# Altium project LISC-XC95144XL.PrjPCB
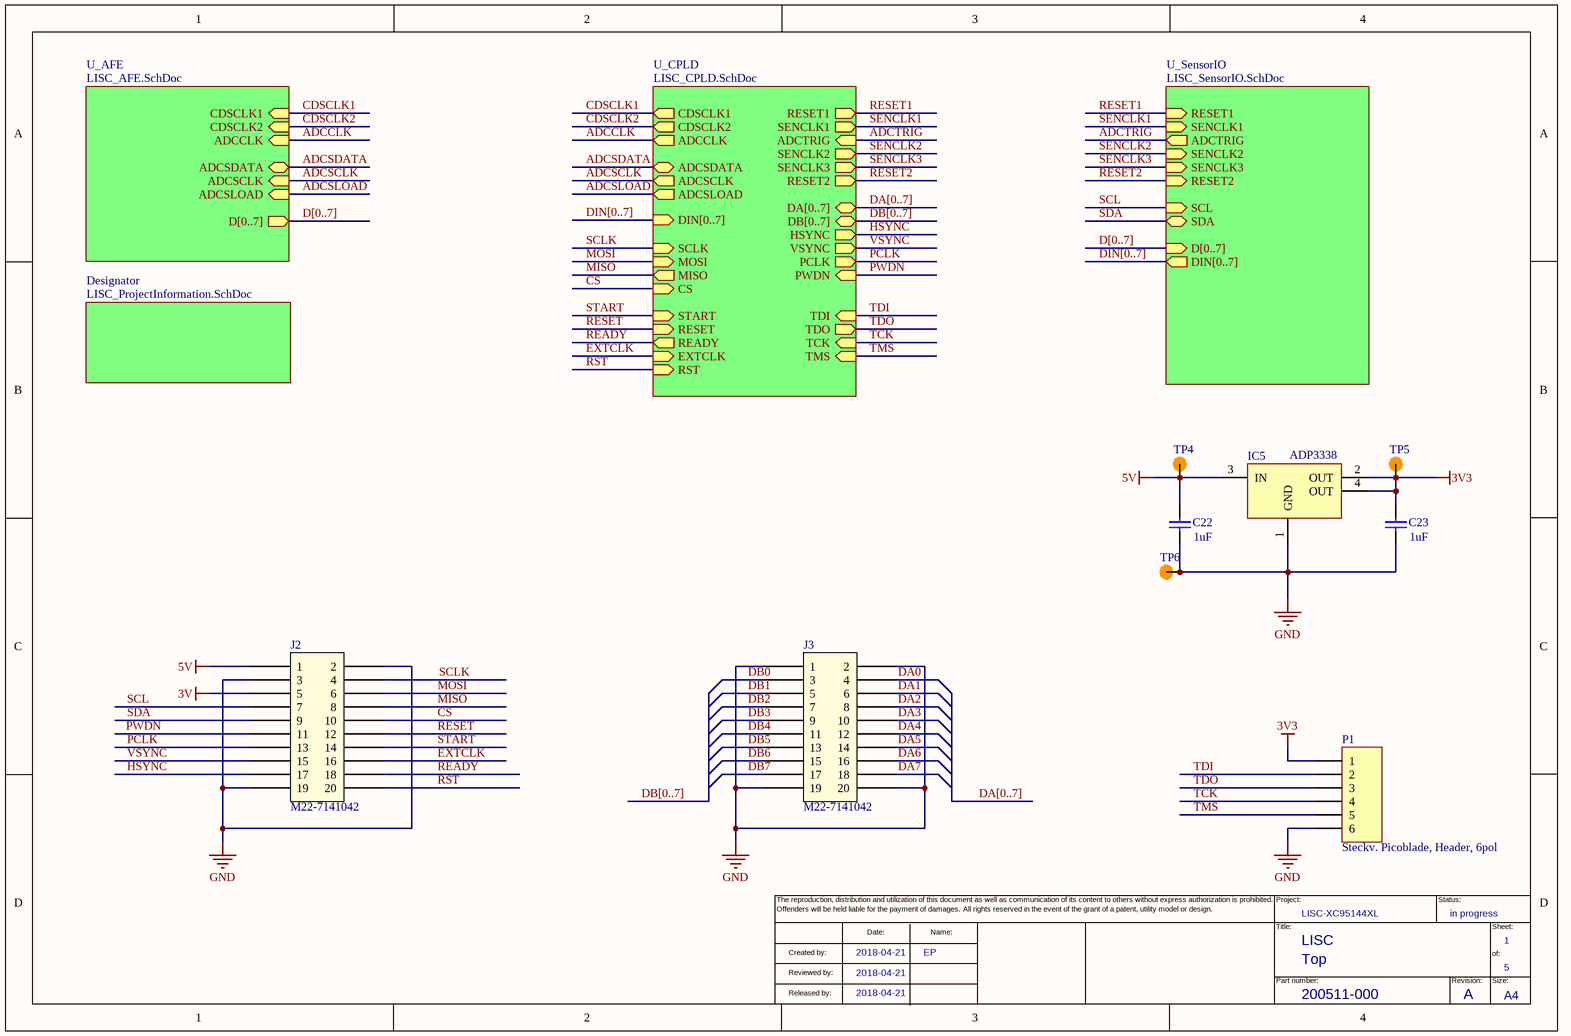
[diagram p0: LISC_TopLevel.SchDoc]
5 sheets, 47 parts. Net scope: hierarchical (ports join the sheet entries above them; power ports are global).
Board file: LISC-XC95144XL.PcbDoc
Sheets:
  LISC_TopLevel.SchDoc
    U_AFE = LISC_AFE.SchDoc
    U_SensorIO = LISC_SensorIO.SchDoc
    U_CPLD = LISC_CPLD.SchDoc
    Designator = LISC_ProjectInformation.SchDoc

## Sheet LISC_TopLevel.SchDoc: LISC
size A4; Date: 2018-04-21; Author: EP; Organization: eptecon; Revision: A; SheetNumber: 1; SheetTotal: 5; PartNumber: 200511-000; DesignStatus: in progress; Project: LISC-XC95144XL; SheetTitle: Top; ProjectName: Project Name

### Parts
C22  value 1uF  [1608[0603]]
C23  value 1uF  [1608[0603]]
IC5  ADP3338  [SOT223-4L]
J2  M22-7141042  [PCBComponent_1]
J3  M22-7141042  [PCBComponent_1]
P1  Steckv. Picoblade, Header, 6pol  [PicoBlade Header 6Pin gerade]
TP4  TP_SMD  [TP100_200_NS]  (value not drawn)
TP5  TP_SMD  [TP100_200_NS]  (value not drawn)
TP6  TP_SMD  [TP100_200_NS]  (value not drawn)

### Sub-sheets
Designator = LISC_ProjectInformation.SchDoc: no entries
U_AFE = LISC_AFE.SchDoc: CDSCLK1 (in), CDSCLK2 (in), ADCCLK (in), ADCSDATA (bidir), ADCSCLK (in), ADCSLOAD (in), D[0..7] (out)
U_CPLD = LISC_CPLD.SchDoc: RESET1 (out), SENCLK1 (out), SENCLK2 (out), SENCLK3 (out), RESET2 (out), ADCTRIG (in), CDSCLK1 (out), CDSCLK2 (out), ADCCLK (out), HSYNC (out), VSYNC (out), DA[0..7] (bidir), PCLK (out), PWDN (in), CS (in), MISO (out), MOSI (in), SCLK (in), READY (out), RESET (in), START (in), TDI (in), TDO (out), TCK (in), TMS (in), EXTCLK (in), ADCSDATA (bidir), ADCSCLK (out), ADCSLOAD (out), DIN[0..7] (in), DB[0..7] (bidir), RST (in)
U_SensorIO = LISC_SensorIO.SchDoc: RESET1 (in), SENCLK1 (in), SENCLK2 (in), SENCLK3 (in), RESET2 (in), ADCTRIG (out), SCL (in), SDA (bidir), D[0..7] (in), DIN[0..7] (out)

### Nets
3V: J2.5
3V3: C23.2 IC5.2(OUT) IC5.4(OUT) P1.1 TP5.1
5V: C22.2 IC5.3(IN) J2.1 TP4.1
GND: C22.1 C23.1 IC5.1(GND) J2.2 J2.3 J2.19 J3.1 J3.2 J3.19 J3.20 P1.6 TP6.1
ADCCLK: sheet U_AFE/ADCCLK, sheet U_CPLD/ADCCLK
ADCSCLK: sheet U_AFE/ADCSCLK, sheet U_CPLD/ADCSCLK
ADCSDATA: sheet U_AFE/ADCSDATA, sheet U_CPLD/ADCSDATA
ADCSLOAD: sheet U_AFE/ADCSLOAD, sheet U_CPLD/ADCSLOAD
ADCTRIG: sheet U_SensorIO/ADCTRIG, sheet U_CPLD/ADCTRIG
CDSCLK1: sheet U_AFE/CDSCLK1, sheet U_CPLD/CDSCLK1
CDSCLK2: sheet U_AFE/CDSCLK2, sheet U_CPLD/CDSCLK2
CS: J2.10 ; sheet U_CPLD/CS
DA0: J3.4
DA1: J3.6
DA2: J3.8
DA3: J3.10
DA4: J3.12
DA5: J3.14
DA6: J3.16
DA7: J3.18
DB0: J3.3
DB1: J3.5
DB2: J3.7
DB3: J3.9
DB4: J3.11
DB5: J3.13
DB6: J3.15
DB7: J3.17
EXTCLK: J2.16 ; sheet U_CPLD/EXTCLK
HSYNC: J2.17 ; sheet U_CPLD/HSYNC
MISO: J2.8 ; sheet U_CPLD/MISO
MOSI: J2.6 ; sheet U_CPLD/MOSI
PCLK: J2.13 ; sheet U_CPLD/PCLK
PWDN: J2.11 ; sheet U_CPLD/PWDN
READY: J2.18 ; sheet U_CPLD/READY
RESET: J2.12 ; sheet U_CPLD/RESET
RESET1: sheet U_SensorIO/RESET1, sheet U_CPLD/RESET1
RESET2: sheet U_SensorIO/RESET2, sheet U_CPLD/RESET2
RST: J2.20 ; sheet U_CPLD/RST
SCL: J2.7 ; sheet U_SensorIO/SCL
SCLK: J2.4 ; sheet U_CPLD/SCLK
SDA: J2.9 ; sheet U_SensorIO/SDA
SENCLK1: sheet U_SensorIO/SENCLK1, sheet U_CPLD/SENCLK1
SENCLK2: sheet U_SensorIO/SENCLK2, sheet U_CPLD/SENCLK2
SENCLK3: sheet U_SensorIO/SENCLK3, sheet U_CPLD/SENCLK3
START: J2.14 ; sheet U_CPLD/START
TCK: P1.4 ; sheet U_CPLD/TCK
TDI: P1.2 ; sheet U_CPLD/TDI
TDO: P1.3 ; sheet U_CPLD/TDO
TMS: P1.5 ; sheet U_CPLD/TMS
VSYNC: J2.15 ; sheet U_CPLD/VSYNC

### Buses and harness runs
bus D[0..7] = sheet U_AFE/D[0..7]
bus D[0..7] = sheet U_SensorIO/D[0..7]
bus DA[0..7]
bus DA[0..7] = sheet U_CPLD/DA[0..7]
bus DB[0..7]
bus DB[0..7] = sheet U_CPLD/DB[0..7]
bus DIN[0..7] = sheet U_CPLD/DIN[0..7]
bus DIN[0..7] = sheet U_SensorIO/DIN[0..7]

### Notes on the sheet
- The reproduction, distribution and utilization of this document as well as communication of its content to others without express authorization is prohibited.
- Offenders will be held liable for the payment of damages.
- All rights reserved in the event of the grant of a patent, utility model or design.
- Project:
- Status:
- Created by:
- Reviewed by:
- Date:
- Name:
- Title:
- Part number:
- Revision:
- Size:
- Sheet:
- of:
- Released by:
- A4

### Library data of the parts
C22 C23 = Cap Semi: Capacitor (Semiconductor SIM Model); Published: 8-Jun-2000; LatestRevisionDate: 29-May-2009; LatestRevisionNote: IPC-7351 Footprint Added.; PackageReference: C1206; Publisher: Altium Limited; PackageDescription: Chip Capacitor
IC5 = ADP3338: High Accuracy, Ultralow IQ, 1 A,  anyCAP® Low Dropout Regulator; Value: ADP3338; Supplier 1: Farnell; Supplier Part Number 1: 1651283
J2 J3 = M22-7141042: Harwig M22-7141042
P1 = 1.25mm Pitch PicoBlade™ Wire-to-Board Header, Vertical, with Friction Lock, 6 Circuits: MOLEX - 53047-0610 - STECKER,VERTIKAL,6KONT; Steckverbindertyp: Draht zu Platine; Kontaktanschluss: Durchsteckmontage, vertikal; Kontakte, Anzahl der: 6; Reihen, Anzahl der: 1; Raster: 1.25; Kontaktüberzug: Zinn; Kontaktmaterial: Phosphor-Bronze; Anschlussart: Lötmittel; Gehäusetyp: GF Nylon UL94V-0; Isolations-Widerstand: 100; Länge/Höhe, Außen-: 3.5; Min Betriebstemperatur: -40; Spannung, Betriebs-: 125; Spannung, Steh-: 250; Temperatur, Betriebs- max.: 85; Tiefe, Außen: 5.5; Supplier 1: Farnell; Manufacturer: MOLEX; Manufacturer Part Number: 53047-0610; RoHS: YES; Stock 1: 35787; Pricing 1: 5=0,673, 100=0,42, 250=0,358, 500=0,34, 1000=0,311 (EUR); Serie: PicoBlade; Gender: Header; Anschlusstyp: Draht zu Platine; Body Plating: Zinn; Nennstrom: 1; Pole, Anzahl der: 6; Raster, Anschluss: 1.25; Spannung, Nenn-, AC: 125; Wege, Anzahl der: 6; ComponentLink1URL: http://www.farnell.com/cad/694680.pdf; ComponentLink1Description: http://www.farnell.com/cad/694680.pdf; ComponentLink2URL: http://www.farnell.com/datasheets/524695.pdf; ComponentLink2Description: http://www.farnell.com/datasheets/524695.pdf; Supplier Part Number 1: 9733078

## Sheet LISC_AFE.SchDoc: LISC
size A4; Date: 2018-04-21; Author: EP; Organization: eptecon; Revision: A; SheetNumber: 3; SheetTotal: 5; PartNumber: 200511-000; DesignStatus: in progress; Project: LISC-XC95144XL; SheetTitle: Analog Frontend; ProjectName: Project Name
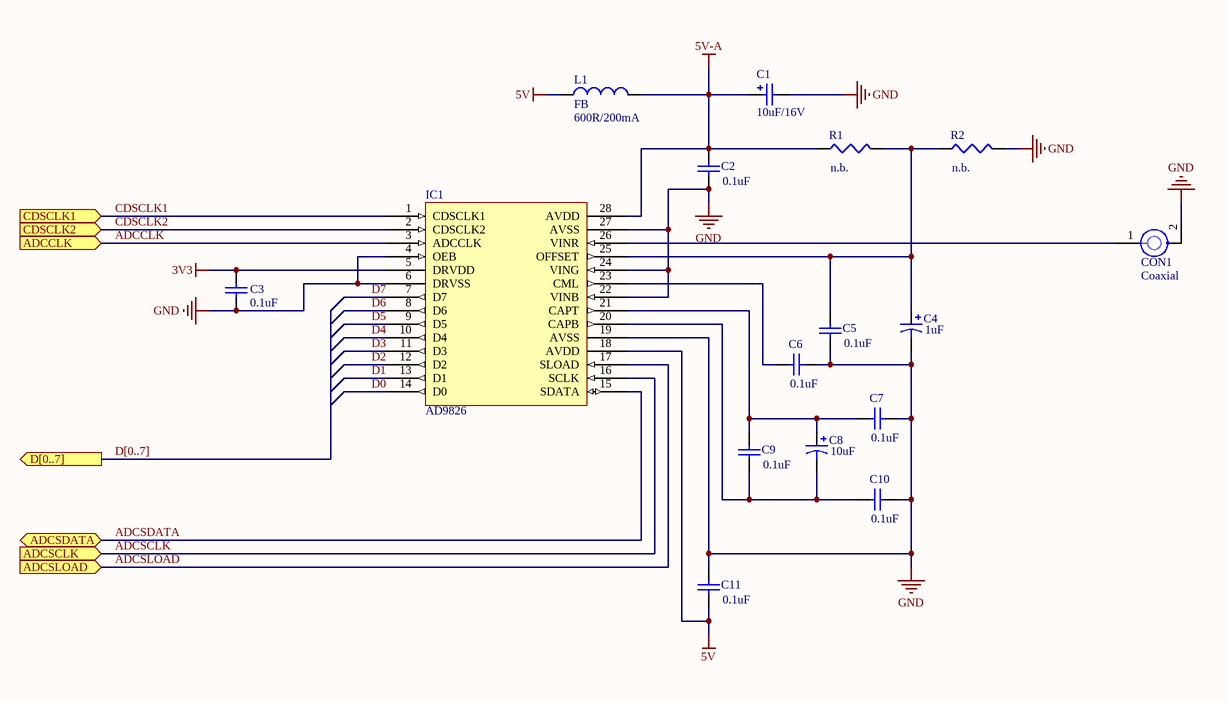
[diagram p1: LISC_AFE.SchDoc]

### Parts
C1  10uF/16V  [C1210 Pol]
C2  value 0.1uF  [1608[0603]]
C3  value 0.1uF  [1608[0603]]  (hidden comment: Cap Semi)
C4  value 1uF  [C0805]
C5  value 0.1uF  [1608[0603]]
C6  value 0.1uF  [1608[0603]]
C7  value 0.1uF  [1608[0603]]
C8  value 10uF  [C0805]
C9  value 0.1uF  [1608[0603]]
C10  value 0.1uF  [1608[0603]]
C11  value 0.1uF  [1608[0603]]
CON1  Coaxial  [U.FL-R-SMT]
IC1  AD9826  [SOP65P780-28AM]
L1  FB  value 600R/200mA  [INDC1608L]
R1  value n.b.  [J1-0603]
R2  value n.b.  [J1-0603]

### Ports
ADCCLK (in), ADCSCLK (in), ADCSDATA (bidir), ADCSLOAD (in), CDSCLK1 (in), CDSCLK2 (in), D[0..7] (out)

### Nets
3V3: C3.1 IC1.5(DRVDD)
5V: C11.1 IC1.18(AVDD) L1.1
5V-A: C1.1 C2.2 IC1.28(AVDD) L1.2 R1.1
GND: C1.2 C2.1 C3.2 C4.2 C5.1 C6.1 C7.1 C10.1 C11.2 CON1.2 IC1.4(OEB) IC1.6(DRVSS) IC1.19(AVSS) IC1.22(VINB) IC1.24(VING) IC1.27(AVSS) R2.2
ADCCLK: IC1.3(ADCCLK) ; port ADCCLK
ADCSCLK: IC1.16(SCLK) ; port ADCSCLK
ADCSDATA: IC1.15(SDATA) ; port ADCSDATA
ADCSLOAD: IC1.17(SLOAD) ; port ADCSLOAD
CDSCLK1: IC1.1(CDSCLK1) ; port CDSCLK1
CDSCLK2: IC1.2(CDSCLK2) ; port CDSCLK2
D0: IC1.14(D0)
D1: IC1.13(D1)
D2: IC1.12(D2)
D3: IC1.11(D3)
D4: IC1.10(D4)
D5: IC1.9(D5)
D6: IC1.8(D6)
D7: IC1.7(D7)
NetC4_1: C4.1 C5.2 IC1.25(OFFSET) R1.2 R2.1
NetC6_2: C6.2 IC1.23(CML)
NetC7_2: C7.2 C8.1 C9.2 IC1.21(CAPT)
NetC8_2: C8.2 C9.1 C10.2 IC1.20(CAPB)
NetCON1_1: CON1.1 IC1.26(VINR)

### Buses and harness runs
bus D[0..7] = port D[0..7]

### Notes on the sheet
- The reproduction, distribution and utilization of this document as well as communication of its content to others without express authorization is prohibited.
- Offenders will be held liable for the payment of damages.
- All rights reserved in the event of the grant of a patent, utility model or design.
- Project:
- Status:
- Created by:
- Reviewed by:
- Date:
- Name:
- Title:
- Part number:
- Revision:
- Size:
- Sheet:
- of:
- Released by:
- A4

### Library data of the parts
C1 = Cap EU SMD Pol: Polarized Capacitor (Surface Mount); Value: 10uF; Published: 8-Jun-2000; LatestRevisionDate: 29-May-2009; LatestRevisionNote: IPC-7351 Footprint Added.; PackageReference: C0805; Publisher: Altium Limited; PackageDescription: Chip Capacitor
C2 C3 C5-C7 C9-C11 = Cap Semi: Capacitor (Semiconductor SIM Model); Published: 8-Jun-2000; LatestRevisionDate: 29-May-2009; LatestRevisionNote: IPC-7351 Footprint Added.; PackageReference: C1206; Publisher: Altium Limited; PackageDescription: Chip Capacitor
C4 C8 = Cap Pol3: Polarized Capacitor (Surface Mount); Published: 8-Jun-2000; LatestRevisionDate: 29-May-2009; LatestRevisionNote: IPC-7351 Footprint Added.; PackageReference: C0805; Publisher: Altium Limited; PackageDescription: Chip Capacitor
L1 = Inductor: Code_IEC: 1005; Published: 8-Jun-2000; LatestRevisionDate: 29-May-2009; LatestRevisionNote: IPC-7351 Footprint Added.; PackageReference: 0402-A; Publisher: Altium Limited; PackageDescription: Chip Inductor; Code_JEITA: 0402
R1 R2 = Res3: Resistor; Published: 8-Jun-2000; LatestRevisionDate: 29-May-2009; LatestRevisionNote: IPC-7351 Footprint Added.; PackageReference: J1-0603; Publisher: Altium Limited; PackageDescription: Chip Resistor

## Sheet LISC_SensorIO.SchDoc: LISC
size A4; Date: 2018-04-21; Author: EP; Organization: eptecon; Revision: A; SheetNumber: 5; SheetTotal: 5; PartNumber: 200511-000; DesignStatus: in progress; Project: LISC-XC95144XL; SheetTitle: Sensor I/O; ProjectName: Project Name
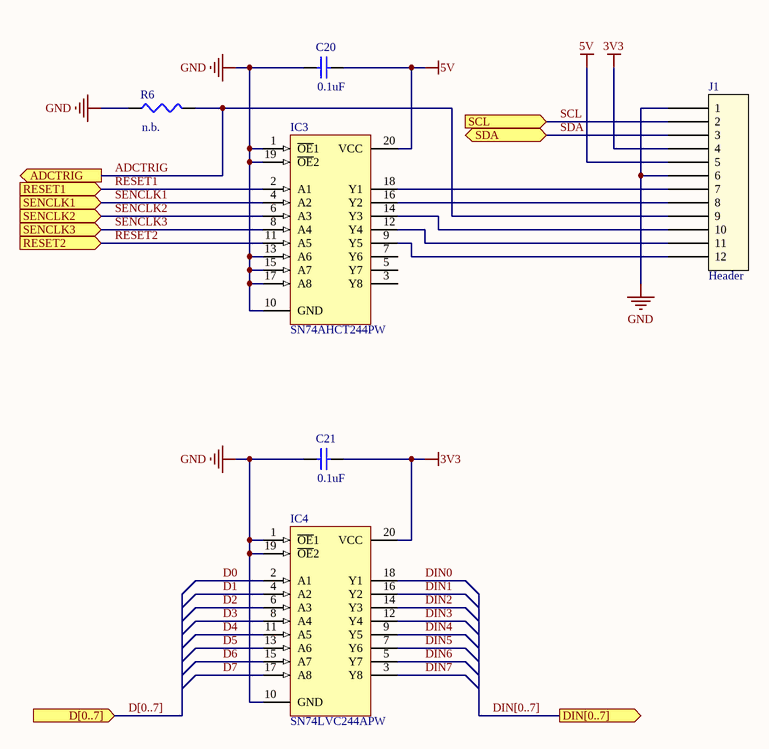
[diagram p2: LISC_SensorIO.SchDoc]

### Parts
C20  value 0.1uF  [1608[0603]]
C21  value 0.1uF  [1608[0603]]
IC3  SN74AHCT244PW  [PW020_M]
IC4  SN74LVC244APW  [PW020_M]
J1  Header  [Molex_Picoflex_12]
R6  value n.b.  [J1-0603]

### Ports
ADCTRIG (out), D[0..7] (in), DIN[0..7] (out), RESET1 (in), RESET2 (in), SCL (in), SDA (bidir), SENCLK1 (in), SENCLK2 (in), SENCLK3 (in)

### Nets
3V3: C21.2 IC4.20(VCC) J1.4
5V: C20.2 IC3.20(VCC) J1.5
GND: C20.1 C21.1 IC3.1(~{OE}1) IC3.10(GND) IC3.13(A6) IC3.15(A7) IC3.17(A8) IC3.19(~{OE}2) IC4.1(~{OE}1) IC4.10(GND) IC4.19(~{OE}2) J1.1 J1.6 R6.1
ADCTRIG: J1.9 R6.2 ; port ADCTRIG
D0: IC4.2(A1)
D1: IC4.4(A2)
D2: IC4.6(A3)
D3: IC4.8(A4)
D4: IC4.11(A5)
D5: IC4.13(A6)
D6: IC4.15(A7)
D7: IC4.17(A8)
DIN0: IC4.18(Y1)
DIN1: IC4.16(Y2)
DIN2: IC4.14(Y3)
DIN3: IC4.12(Y4)
DIN4: IC4.9(Y5)
DIN5: IC4.7(Y6)
DIN6: IC4.5(Y7)
DIN7: IC4.3(Y8)
RESET1: IC3.2(A1) ; port RESET1
RESET2: IC3.11(A5) ; port RESET2
SCL: J1.2 ; port SCL
SDA: J1.3 ; port SDA
SENCLK1: IC3.4(A2) ; port SENCLK1
SENCLK2: IC3.6(A3) ; port SENCLK2
SENCLK3: IC3.8(A4) ; port SENCLK3
NetIC3_9: IC3.9(Y5) J1.12
NetIC3_12: IC3.12(Y4) J1.11
NetIC3_14: IC3.14(Y3) J1.10
NetIC3_16: IC3.16(Y2) J1.8
NetIC3_18: IC3.18(Y1) J1.7

Not connected (* = marked no-connect by the designer): IC3 3(Y8) 5(Y7) 7(Y6)

### Buses and harness runs
bus D[0..7] = port D[0..7]
bus DIN[0..7] = port DIN[0..7]

### Notes on the sheet
- The reproduction, distribution and utilization of this document as well as communication of its content to others without express authorization is prohibited.
- Offenders will be held liable for the payment of damages.
- All rights reserved in the event of the grant of a patent, utility model or design.
- Project:
- Status:
- Created by:
- Reviewed by:
- Date:
- Name:
- Title:
- Part number:
- Revision:
- Size:
- Sheet:
- of:
- Released by:
- A4

### Library data of the parts
C20 C21 = Cap Semi: Capacitor (Semiconductor SIM Model); Published: 8-Jun-2000; LatestRevisionDate: 29-May-2009; LatestRevisionNote: IPC-7351 Footprint Added.; PackageReference: C1206; Publisher: Altium Limited; PackageDescription: Chip Capacitor
IC3 = SN74AHCT244PWLE: Octal Buffer/Driver with 3-State Outputs; ComponentAvailability: Obsolete; Published: 8-Jun-2000; LatestRevisionDate: 16-Oct-2006; LatestRevisionNote: IPC-7351 Footprint Added.; DatasheetVersion: Oct-1998; PackageVersion: Feb-1999; PackageReference: PW020; Publisher: Altium Limited; PackageDescription: 20-Pin Thin Small Outline Package 0.65 mm Pitch; ComponentLink1Description: Manufacturer Link; ComponentLink1URL: http://www.ti.com/; ComponentLink2Description: Datasheet; ComponentLink2URL: http://www-s.ti.com/sc/ds/sn74ahct244.pdf
IC4 = SN74LVC244APW: Octal Buffer/Driver with 3-State Outputs; Published: 8-Jun-2000; LatestRevisionDate: 16-Oct-2006; LatestRevisionNote: IPC-7351 Footprint Added.; DatasheetVersion: Apr-1999; PackageVersion: Feb-1999; PackageReference: PW020; Publisher: Altium Limited; PackageDescription: 20-Pin Thin Small Outline Package 0.65 mm Pitch; ComponentLink1Description: Manufacturer Link; ComponentLink1URL: http://www.ti.com/; ComponentLink2Description: Datasheet; ComponentLink2URL: http://www-s.ti.com/sc/ds/sn74lvc244a.pdf
J1 = Header: Molex Picoflex 12pol.
R6 = Res3: Resistor; Published: 8-Jun-2000; LatestRevisionDate: 29-May-2009; LatestRevisionNote: IPC-7351 Footprint Added.; PackageReference: J1-0603; Publisher: Altium Limited; PackageDescription: Chip Resistor

## Sheet LISC_CPLD.SchDoc: LISC
size A4; Date: 2018-04-21; Author: EP; Organization: eptecon; Revision: A; SheetNumber: 4; SheetTotal: 5; PartNumber: 200511-000; DesignStatus: in progress; Project: LISC-XC95144XL; SheetTitle: CPLD; ProjectName: Project Name
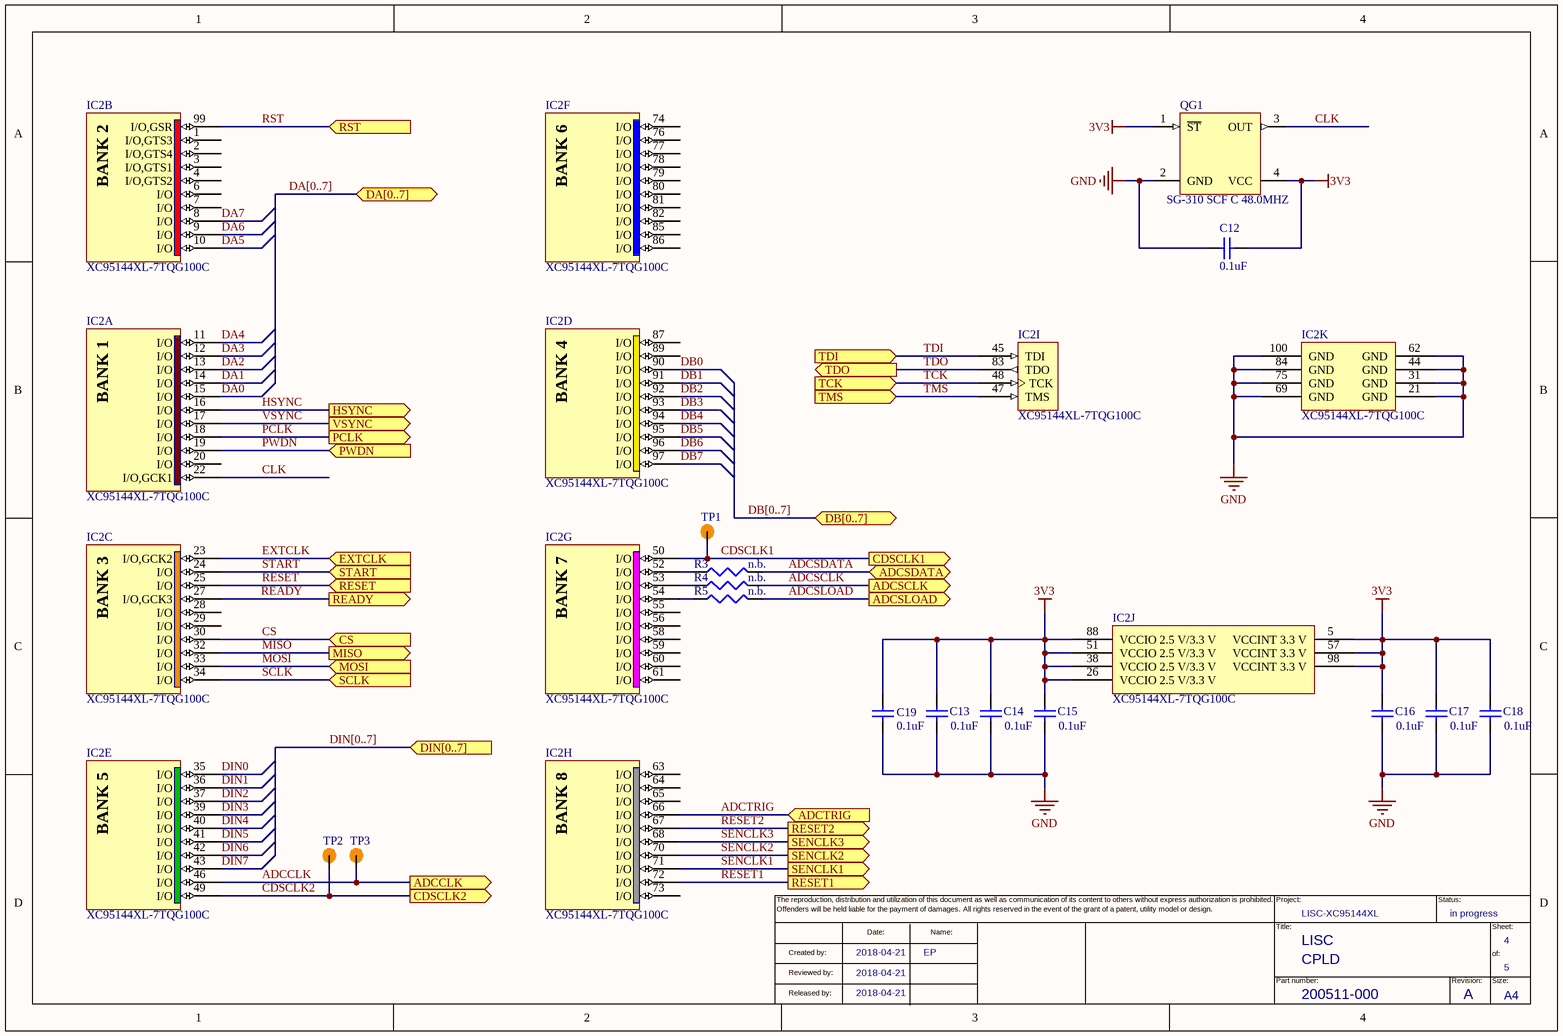
[diagram p3: LISC_CPLD.SchDoc]

### Parts
C12  value 0.1uF  [1608[0603]]  (hidden comment: Cap Semi)
C13  value 0.1uF  [1608[0603]]
C14  value 0.1uF  [1608[0603]]
C15  value 0.1uF  [1608[0603]]
C16  value 0.1uF  [1608[0603]]
C17  value 0.1uF  [1608[0603]]
C18  value 0.1uF  [1608[0603]]
C19  value 0.1uF  [1608[0603]]
IC2  XC95144XL-7TQG100C  [TQG100_N]  (parts A,B,C,D,E,F,G,H,I,J,K of 11)
QG1  SG-310 SCF C 48.0MHZ  [SG-310_Series]
R3  value n.b.  [J1-0603]
R4  value n.b.  [J1-0603]
R5  value n.b.  [J1-0603]
TP1  TP_SMD  [TP100_200_NS]  (value not drawn)
TP2  TP_SMD  [TP100_200_NS]  (value not drawn)
TP3  TP_SMD  [TP100_200_NS]  (value not drawn)

### Ports
ADCCLK (out), ADCSCLK (out), ADCSDATA (bidir), ADCSLOAD (out), ADCTRIG (in), CDSCLK1 (out), CDSCLK2 (out), CS (in), DA[0..7] (bidir), DB[0..7] (bidir), DIN[0..7] (in), EXTCLK (in), HSYNC (out), MISO (out), MOSI (in), PCLK (out), PWDN (in), READY (out), RESET1 (out), RESET2 (out), RESET (in), RST (in), SCLK (in), SENCLK1 (out), SENCLK2 (out), SENCLK3 (out), START (in), TCK (in), TDI (in), TDO (out), TMS (in), VSYNC (out)

### Nets
3V3: C12.2 C13.1 C14.1 C15.1 C16.1 C17.1 C18.1 C19.1 IC2.5(VCCINT_3.3_V) IC2.26(VCCIO_2.5_V/3.3_V) IC2.38(VCCIO_2.5_V/3.3_V) IC2.51(VCCIO_2.5_V/3.3_V) IC2.57(VCCINT_3.3_V) IC2.88(VCCIO_2.5_V/3.3_V) IC2.98(VCCINT_3.3_V) QG1.1(~{ST}) QG1.4(VCC)
GND: C12.1 C13.2 C14.2 C15.2 C16.2 C17.2 C18.2 C19.2 IC2.21(GND) IC2.31(GND) IC2.44(GND) IC2.62(GND) IC2.69(GND) IC2.75(GND) IC2.84(GND) IC2.100(GND) QG1.2(GND)
ADCCLK: IC2.46(I/O) TP3.1 ; port ADCCLK
ADCSCLK: R4.2 ; port ADCSCLK
ADCSDATA: R3.2 ; port ADCSDATA
ADCSLOAD: R5.2 ; port ADCSLOAD
ADCTRIG: IC2.66(I/O) ; port ADCTRIG
CDSCLK1: IC2.50(I/O) TP1.1 ; port CDSCLK1
CDSCLK2: IC2.49(I/O) TP2.1 ; port CDSCLK2
CLK: IC2.22(I/O,GCK1) QG1.3(OUT)
CS: IC2.30(I/O) ; port CS
DA0: IC2.15(I/O)
DA1: IC2.14(I/O)
DA2: IC2.13(I/O)
DA3: IC2.12(I/O)
DA4: IC2.11(I/O)
DA5: IC2.10(I/O)
DA6: IC2.9(I/O)
DA7: IC2.8(I/O)
DB0: IC2.90(I/O)
DB1: IC2.91(I/O)
DB2: IC2.92(I/O)
DB3: IC2.93(I/O)
DB4: IC2.94(I/O)
DB5: IC2.95(I/O)
DB6: IC2.96(I/O)
DB7: IC2.97(I/O)
DIN0: IC2.35(I/O)
DIN1: IC2.36(I/O)
DIN2: IC2.37(I/O)
DIN3: IC2.39(I/O)
DIN4: IC2.40(I/O)
DIN5: IC2.41(I/O)
DIN6: IC2.42(I/O)
DIN7: IC2.43(I/O)
EXTCLK: IC2.23(I/O,GCK2) ; port EXTCLK
HSYNC: IC2.16(I/O) ; port HSYNC
MISO: IC2.32(I/O) ; port MISO
MOSI: IC2.33(I/O) ; port MOSI
PCLK: IC2.18(I/O) ; port PCLK
PWDN: IC2.19(I/O) ; port PWDN
READY: IC2.27(I/O,GCK3) ; port READY
RESET: IC2.25(I/O) ; port RESET
RESET1: IC2.72(I/O) ; port RESET1
RESET2: IC2.67(I/O) ; port RESET2
RST: IC2.99(I/O,GSR) ; port RST
SCLK: IC2.34(I/O) ; port SCLK
SENCLK1: IC2.71(I/O) ; port SENCLK1
SENCLK2: IC2.70(I/O) ; port SENCLK2
SENCLK3: IC2.68(I/O) ; port SENCLK3
START: IC2.24(I/O) ; port START
TCK: IC2.48(TCK) ; port TCK
TDI: IC2.45(TDI) ; port TDI
TDO: IC2.83(TDO) ; port TDO
TMS: IC2.47(TMS) ; port TMS
VSYNC: IC2.17(I/O) ; port VSYNC
NetIC2_52: IC2.52(I/O) R3.1
NetIC2_53: IC2.53(I/O) R4.1
NetIC2_54: IC2.54(I/O) R5.1

Not connected (* = marked no-connect by the designer): IC2 1(I/O,GTS3) 2(I/O,GTS4) 3(I/O,GTS1) 4(I/O,GTS2) 6(I/O) 7(I/O) 20(I/O) 28(I/O) 29(I/O) 55(I/O) 56(I/O) 58(I/O) 59(I/O) 60(I/O) 61(I/O) 63(I/O) 64(I/O) 65(I/O) 73(I/O) 74(I/O) 76(I/O) 77(I/O) 78(I/O) 79(I/O) 80(I/O) 81(I/O) 82(I/O) 85(I/O) 86(I/O) 87(I/O) 89(I/O)

### Buses and harness runs
bus DA[0..7] = port DA[0..7]
bus DB[0..7] = port DB[0..7]
bus DIN[0..7] = port DIN[0..7]

### Notes on the sheet
- The reproduction, distribution and utilization of this document as well as communication of its content to others without express authorization is prohibited.
- Offenders will be held liable for the payment of damages.
- All rights reserved in the event of the grant of a patent, utility model or design.
- Project:
- Status:
- Created by:
- Reviewed by:
- Date:
- Name:
- Title:
- Part number:
- Revision:
- Size:
- Sheet:
- of:
- Released by:
- A4
- (in symbol XC95144XL-7TQG100C, part A) BANK 1
- (in symbol XC95144XL-7TQG100C, part B) BANK 2
- (in symbol XC95144XL-7TQG100C, part C) BANK 3
- (in symbol XC95144XL-7TQG100C, part D) BANK 4
- (in symbol XC95144XL-7TQG100C, part E) BANK 5
- (in symbol XC95144XL-7TQG100C, part F) BANK 6
- (in symbol XC95144XL-7TQG100C, part G) BANK 7
- (in symbol XC95144XL-7TQG100C, part H) BANK 8

### Library data of the parts
C12-C19 = Cap Semi: Capacitor (Semiconductor SIM Model); Published: 8-Jun-2000; LatestRevisionDate: 29-May-2009; LatestRevisionNote: IPC-7351 Footprint Added.; PackageReference: C1206; Publisher: Altium Limited; PackageDescription: Chip Capacitor
IC2 = XC95144XL-7TQG100C: FastFLASH XC900XL, 3.3V High-Performance CPLD with 144 Macrocells, 100-Pin TQFP, Commercial Grade, Pb-Free; Published: 8-Sep-2006; DatasheetVersion: ver1.9, Mar-2006; PackageVersion: ver1.2, Jun-2004; PackageReference: TQG100; Publisher: Altium Limited; PackageDescription: 100-Pin Thin Quad Flat Pack (TQG100) - Pb-Free; ComponentLink1Description: Manufacturer Link; ComponentLink1URL: http://www.xilinx.com/products/silicon_solutions/cplds/xc9500_series/xc9500xl/index.htm; ComponentLink2Description: Datasheet; ComponentLink2URL: http://direct.xilinx.com/bvdocs/publications/ds056.pdf
QG1 = SG-310 SCF C 20.0MHZ: EPSON TOYOCOM - SG-310 SCF C 20.0MHZ - OSZILLATOR, SM 3,2X2,5MM 20,0MHZ; Supplier 1: Farnell; Manufacturer: EPSON TOYOCOM; Manufacturer Part Number: SG-310 SCF C 20.0MHZ; RoHS: YES; Stock 1: 1225; Pricing 1: 1=3,39, 10=2,77, 100=2,39, 250=2,04, 500=1,97 (EUR); ComponentLink1URL: http://www.farnell.com/datasheets/57484.pdf; ComponentLink1Description: http://www.farnell.com/datasheets/57484.pdf; Supplier Part Number 1: 1278064
R3-R5 = Res3: Resistor; Published: 8-Jun-2000; LatestRevisionDate: 29-May-2009; LatestRevisionNote: IPC-7351 Footprint Added.; PackageReference: J1-0603; Publisher: Altium Limited; PackageDescription: Chip Resistor

## Sheet LISC_ProjectInformation.SchDoc: LISC
size A4; EditBy: +; Date: 2018-04-21; Author: EP; Organization: eptecon; Revision: A; SheetNumber: 2; SheetTotal: 5; PartNumber: 200511-000; DesignStatus: in progress; Project: LISC-XC95144XL; SheetTitle: Project Info; ProjectName: Project Name
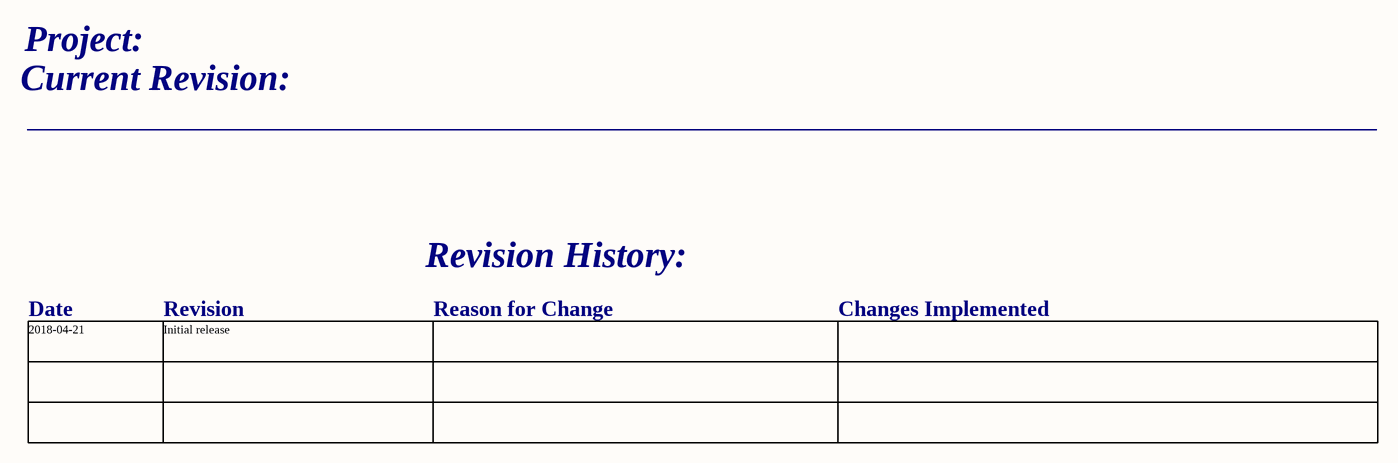
[diagram p4: LISC_ProjectInformation.SchDoc]

### Notes on the sheet
- Current Revision:
- Project:
- Date
- Revision
- Revision History:
- Reason for Change
- Changes Implemented
- 2018-04-21
- Initial release
- The reproduction, distribution and utilization of this document as well as communication of its content to others without express authorization is prohibited.
- Offenders will be held liable for the payment of damages.
- All rights reserved in the event of the grant of a patent, utility model or design.
- Status:
- Created by:
- Reviewed by:
- Date:
- Name:
- Title:
- Part number:
- Revision:
- Size:
- Sheet:
- of:
- Released by:
- A4

## Nets that join several sheets
3V3: LISC_TopLevel (5 pins), LISC_AFE (C3.1 IC1.5), LISC_SensorIO (C21.2 IC4.20 J1.4), LISC_CPLD (17 pins)
5V: LISC_TopLevel (C22.2 IC5.3 J2.1 TP4.1), LISC_AFE (C11.1 IC1.18 L1.1), LISC_SensorIO (C20.2 IC3.20 J1.5)
GND: LISC_TopLevel (12 pins), LISC_AFE (17 pins), LISC_SensorIO (14 pins), LISC_CPLD (17 pins)
ADCCLK: LISC_AFE (IC1.3), LISC_CPLD (IC2.46 TP3.1)
ADCSCLK: LISC_AFE (IC1.16), LISC_CPLD (R4.2)
ADCSDATA: LISC_AFE (IC1.15), LISC_CPLD (R3.2)
ADCSLOAD: LISC_AFE (IC1.17), LISC_CPLD (R5.2)
ADCTRIG: LISC_SensorIO (J1.9 R6.2), LISC_CPLD (IC2.66)
CDSCLK1: LISC_AFE (IC1.1), LISC_CPLD (IC2.50 TP1.1)
CDSCLK2: LISC_AFE (IC1.2), LISC_CPLD (IC2.49 TP2.1)
CS: LISC_TopLevel (J2.10), LISC_CPLD (IC2.30)
D0: LISC_AFE (IC1.14), LISC_SensorIO (IC4.2)
D1: LISC_AFE (IC1.13), LISC_SensorIO (IC4.4)
D2: LISC_AFE (IC1.12), LISC_SensorIO (IC4.6)
D3: LISC_AFE (IC1.11), LISC_SensorIO (IC4.8)
D4: LISC_AFE (IC1.10), LISC_SensorIO (IC4.11)
D5: LISC_AFE (IC1.9), LISC_SensorIO (IC4.13)
D6: LISC_AFE (IC1.8), LISC_SensorIO (IC4.15)
D7: LISC_AFE (IC1.7), LISC_SensorIO (IC4.17)
DA0: LISC_TopLevel (J3.4), LISC_CPLD (IC2.15)
DA1: LISC_TopLevel (J3.6), LISC_CPLD (IC2.14)
DA2: LISC_TopLevel (J3.8), LISC_CPLD (IC2.13)
DA3: LISC_TopLevel (J3.10), LISC_CPLD (IC2.12)
DA4: LISC_TopLevel (J3.12), LISC_CPLD (IC2.11)
DA5: LISC_TopLevel (J3.14), LISC_CPLD (IC2.10)
DA6: LISC_TopLevel (J3.16), LISC_CPLD (IC2.9)
DA7: LISC_TopLevel (J3.18), LISC_CPLD (IC2.8)
DB0: LISC_TopLevel (J3.3), LISC_CPLD (IC2.90)
DB1: LISC_TopLevel (J3.5), LISC_CPLD (IC2.91)
DB2: LISC_TopLevel (J3.7), LISC_CPLD (IC2.92)
DB3: LISC_TopLevel (J3.9), LISC_CPLD (IC2.93)
DB4: LISC_TopLevel (J3.11), LISC_CPLD (IC2.94)
DB5: LISC_TopLevel (J3.13), LISC_CPLD (IC2.95)
DB6: LISC_TopLevel (J3.15), LISC_CPLD (IC2.96)
DB7: LISC_TopLevel (J3.17), LISC_CPLD (IC2.97)
DIN0: LISC_SensorIO (IC4.18), LISC_CPLD (IC2.35)
DIN1: LISC_SensorIO (IC4.16), LISC_CPLD (IC2.36)
DIN2: LISC_SensorIO (IC4.14), LISC_CPLD (IC2.37)
DIN3: LISC_SensorIO (IC4.12), LISC_CPLD (IC2.39)
DIN4: LISC_SensorIO (IC4.9), LISC_CPLD (IC2.40)
DIN5: LISC_SensorIO (IC4.7), LISC_CPLD (IC2.41)
DIN6: LISC_SensorIO (IC4.5), LISC_CPLD (IC2.42)
DIN7: LISC_SensorIO (IC4.3), LISC_CPLD (IC2.43)
EXTCLK: LISC_TopLevel (J2.16), LISC_CPLD (IC2.23)
HSYNC: LISC_TopLevel (J2.17), LISC_CPLD (IC2.16)
MISO: LISC_TopLevel (J2.8), LISC_CPLD (IC2.32)
MOSI: LISC_TopLevel (J2.6), LISC_CPLD (IC2.33)
PCLK: LISC_TopLevel (J2.13), LISC_CPLD (IC2.18)
PWDN: LISC_TopLevel (J2.11), LISC_CPLD (IC2.19)
READY: LISC_TopLevel (J2.18), LISC_CPLD (IC2.27)
RESET: LISC_TopLevel (J2.12), LISC_CPLD (IC2.25)
RESET1: LISC_SensorIO (IC3.2), LISC_CPLD (IC2.72)
RESET2: LISC_SensorIO (IC3.11), LISC_CPLD (IC2.67)
RST: LISC_TopLevel (J2.20), LISC_CPLD (IC2.99)
SCL: LISC_TopLevel (J2.7), LISC_SensorIO (J1.2)
SCLK: LISC_TopLevel (J2.4), LISC_CPLD (IC2.34)
SDA: LISC_TopLevel (J2.9), LISC_SensorIO (J1.3)
SENCLK1: LISC_SensorIO (IC3.4), LISC_CPLD (IC2.71)
SENCLK2: LISC_SensorIO (IC3.6), LISC_CPLD (IC2.70)
SENCLK3: LISC_SensorIO (IC3.8), LISC_CPLD (IC2.68)
START: LISC_TopLevel (J2.14), LISC_CPLD (IC2.24)
TCK: LISC_TopLevel (P1.4), LISC_CPLD (IC2.48)
TDI: LISC_TopLevel (P1.2), LISC_CPLD (IC2.45)
TDO: LISC_TopLevel (P1.3), LISC_CPLD (IC2.83)
TMS: LISC_TopLevel (P1.5), LISC_CPLD (IC2.47)
VSYNC: LISC_TopLevel (J2.15), LISC_CPLD (IC2.17)